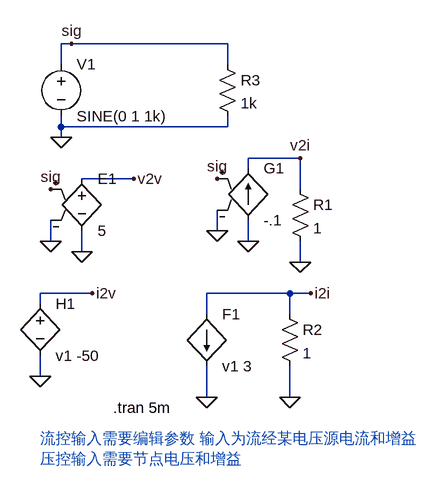
[diagram p0: schematic Draft7.asc]
Draft7.asc, the LTspice schematic file:
Version 4.1
SHEET 1 880 680
WIRE 112 -128 96 -128
WIRE 352 -128 112 -128
WIRE 96 -96 96 -128
WIRE 352 -96 352 -128
WIRE 96 0 96 -16
WIRE 352 0 352 -16
WIRE 352 0 96 0
WIRE 96 16 96 0
WIRE 464 48 384 48
WIRE 384 64 384 48
WIRE 208 80 128 80
WIRE 464 96 464 48
WIRE 336 160 336 128
WIRE 80 176 80 144
WIRE 384 176 384 144
WIRE 128 192 128 160
WIRE 464 208 464 176
WIRE 144 256 64 256
WIRE 448 256 320 256
WIRE 480 256 448 256
WIRE 64 272 64 256
WIRE 320 288 320 256
WIRE 448 288 448 256
WIRE 64 384 64 352
WIRE 320 416 320 368
WIRE 448 416 448 368
FLAG 96 16 0
FLAG 80 96 sig
FLAG 80 176 0
FLAG 208 80 v2v
FLAG 336 160 0
FLAG 336 80 sig
FLAG 464 48 v2i
FLAG 464 208 0
FLAG 64 384 0
FLAG 144 256 i2v
FLAG 320 416 0
FLAG 448 416 0
FLAG 480 256 i2i
FLAG 128 192 0
FLAG 384 176 0
FLAG 112 -128 sig
SYMBOL e 128 64 R0
SYMATTR InstName E1
SYMATTR Value 5
SYMBOL voltage 96 -112 R0
WINDOW 123 0 0 Left 0
WINDOW 39 0 0 Left 0
SYMATTR InstName V1
SYMATTR Value SINE(0 1 1k)
SYMBOL g 384 48 R0
SYMATTR InstName G1
SYMATTR Value -.1
SYMBOL res 448 80 R0
SYMATTR InstName R1
SYMATTR Value 1
SYMBOL h 64 256 R0
SYMATTR InstName H1
SYMATTR Value v1 -50
SYMBOL f 320 288 R0
SYMATTR InstName F1
SYMATTR Value v1 3
SYMBOL res 432 272 R0
SYMATTR InstName R2
SYMATTR Value 1
SYMBOL res 336 -112 R0
SYMATTR InstName R3
SYMATTR Value 1k
TEXT 176 432 Left 2 !.tran 5m
TEXT 64 480 Left 2 ;流控输入需要编辑参数 输入为流经某电压源电流和增益\n压控输入需要节点电压和增益

The netlist it stands for:
* Draft7.asc
E1 v2v 0 sig 0 5
V1 sig 0 SINE(0 1 1k)
G1 0 v2i sig 0 -.1
R1 v2i 0 1
H1 i2v 0 v1 -50
F1 i2i 0 v1 3
R2 i2i 0 1
R3 sig 0 1k
.tran 5m
* 流控输入需要编辑参数 输入为流经某电压源电流和增益
* 压控输入需要节点电压和增益
.backanno
.end

* Results of the author's LTspice run, read from the files saved beside the schematic
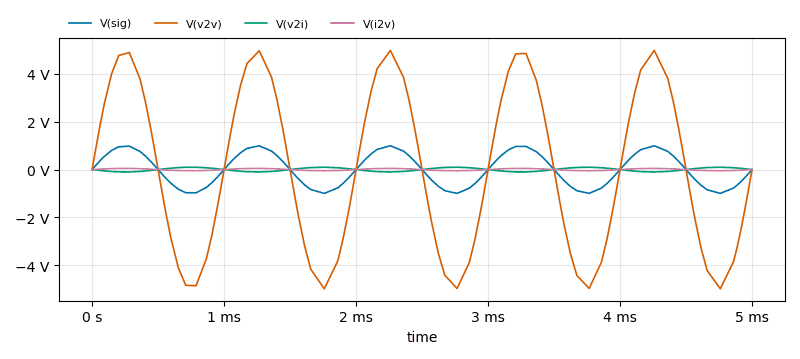
[diagram p1: Transient Analysis of Draft7.asc, plotted from the saved traces]
* Transient Analysis, 1 run:
*   V(sig): min -997.3 mV, max 997.3 mV, average 263.6 µV, rms 696.2 mV, last 0 V
*   V(v2v): min -4.986 V, max 4.986 V, average 1.318 mV, rms 3.481 V, last 0 V
*   V(v2i): min -99.73 mV, max 99.73 mV, average -26.36 µV, rms 69.62 mV, last 0 V
*   V(i2v): min -49.86 mV, max 49.86 mV, average 13.18 µV, rms 34.81 mV, last 0 V